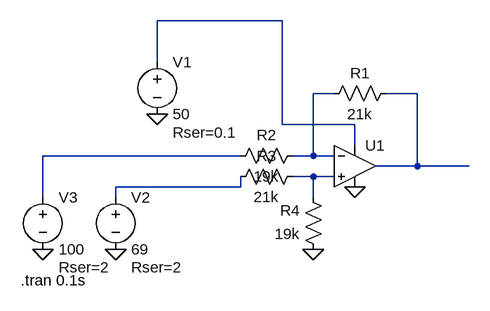
[diagram p0: schematic No Idea.asc]
No Idea.asc, the LTspice schematic file:
Version 4
SHEET 1 880 680
WIRE 48 -64 -144 -64
WIRE -144 0 -144 -64
WIRE 128 48 96 48
WIRE 256 48 208 48
WIRE 48 96 48 -64
WIRE 160 96 48 96
WIRE 160 128 160 96
WIRE -16 144 -320 144
WIRE 96 144 96 48
WIRE 96 144 64 144
WIRE 128 144 96 144
WIRE 256 160 256 48
WIRE 256 160 192 160
WIRE 336 160 256 160
WIRE 96 176 64 176
WIRE 128 176 96 176
WIRE -16 192 -16 176
WIRE -16 192 -208 192
WIRE -320 208 -320 144
WIRE -208 208 -208 192
WIRE 96 208 96 176
FLAG 96 288 0
FLAG -144 80 0
FLAG -320 288 0
FLAG -208 288 0
FLAG 160 192 0
SYMBOL res 224 32 R90
WINDOW 0 0 56 VBottom 2
WINDOW 3 32 56 VTop 2
SYMATTR InstName R1
SYMATTR Value 21k
SYMATTR SpiceLine tol=5 pwr=0.2
SYMBOL res 112 304 R180
WINDOW 0 36 76 Left 2
WINDOW 3 36 40 Left 2
SYMATTR InstName R4
SYMATTR Value 19k
SYMATTR SpiceLine tol=5 pwr=0.2
SYMBOL voltage -144 -16 R0
WINDOW 123 0 0 Left 0
WINDOW 39 24 124 Left 2
SYMATTR InstName V1
SYMATTR Value 50
SYMATTR SpiceLine Rser=0.1
SYMBOL voltage -208 192 R0
WINDOW 123 0 0 Left 0
WINDOW 39 24 124 Left 2
SYMATTR InstName V2
SYMATTR Value 69
SYMATTR SpiceLine Rser=2
SYMBOL voltage -320 192 R0
WINDOW 123 0 0 Left 0
WINDOW 39 24 124 Left 2
SYMATTR InstName V3
SYMATTR Value 100
SYMATTR SpiceLine Rser=2
SYMBOL OpAmps\\UniversalOpAmp 160 160 R0
SYMATTR InstName U1
SYMBOL res 80 128 R90
WINDOW 0 0 56 VBottom 2
WINDOW 3 32 56 VTop 2
SYMATTR InstName R2
SYMATTR Value 19k
SYMATTR SpiceLine tol=5 pwr=0.2
SYMBOL res 80 160 R90
WINDOW 0 0 56 VBottom 2
WINDOW 3 32 56 VTop 2
SYMATTR InstName R3
SYMATTR Value 21k
SYMATTR SpiceLine tol=5 pwr=0.2
TEXT -354 336 Left 2 !.tran 0.1s

The netlist it stands for:
* No Idea.asc
R1 N003 N002 21k tol=5 pwr=0.2
R4 0 N005 19k tol=5 pwr=0.2
V1 N001 0 50 Rser=0.1
V2 N006 0 69 Rser=2
V3 N004 0 100 Rser=2
XU1 N005 N002 N001 0 N003 level1 Avol=1Meg GBW=10Meg Vos=0 En=0 Enk=0 In=0 Ink=0 Rin=500Meg  ; pins In+ In- V+ V- OUT
R2 N002 N004 19k tol=5 pwr=0.2
R3 N005 N006 21k tol=5 pwr=0.2
.tran 0.1s
.lib UniversalOpAmp1.lib
.backanno
.end